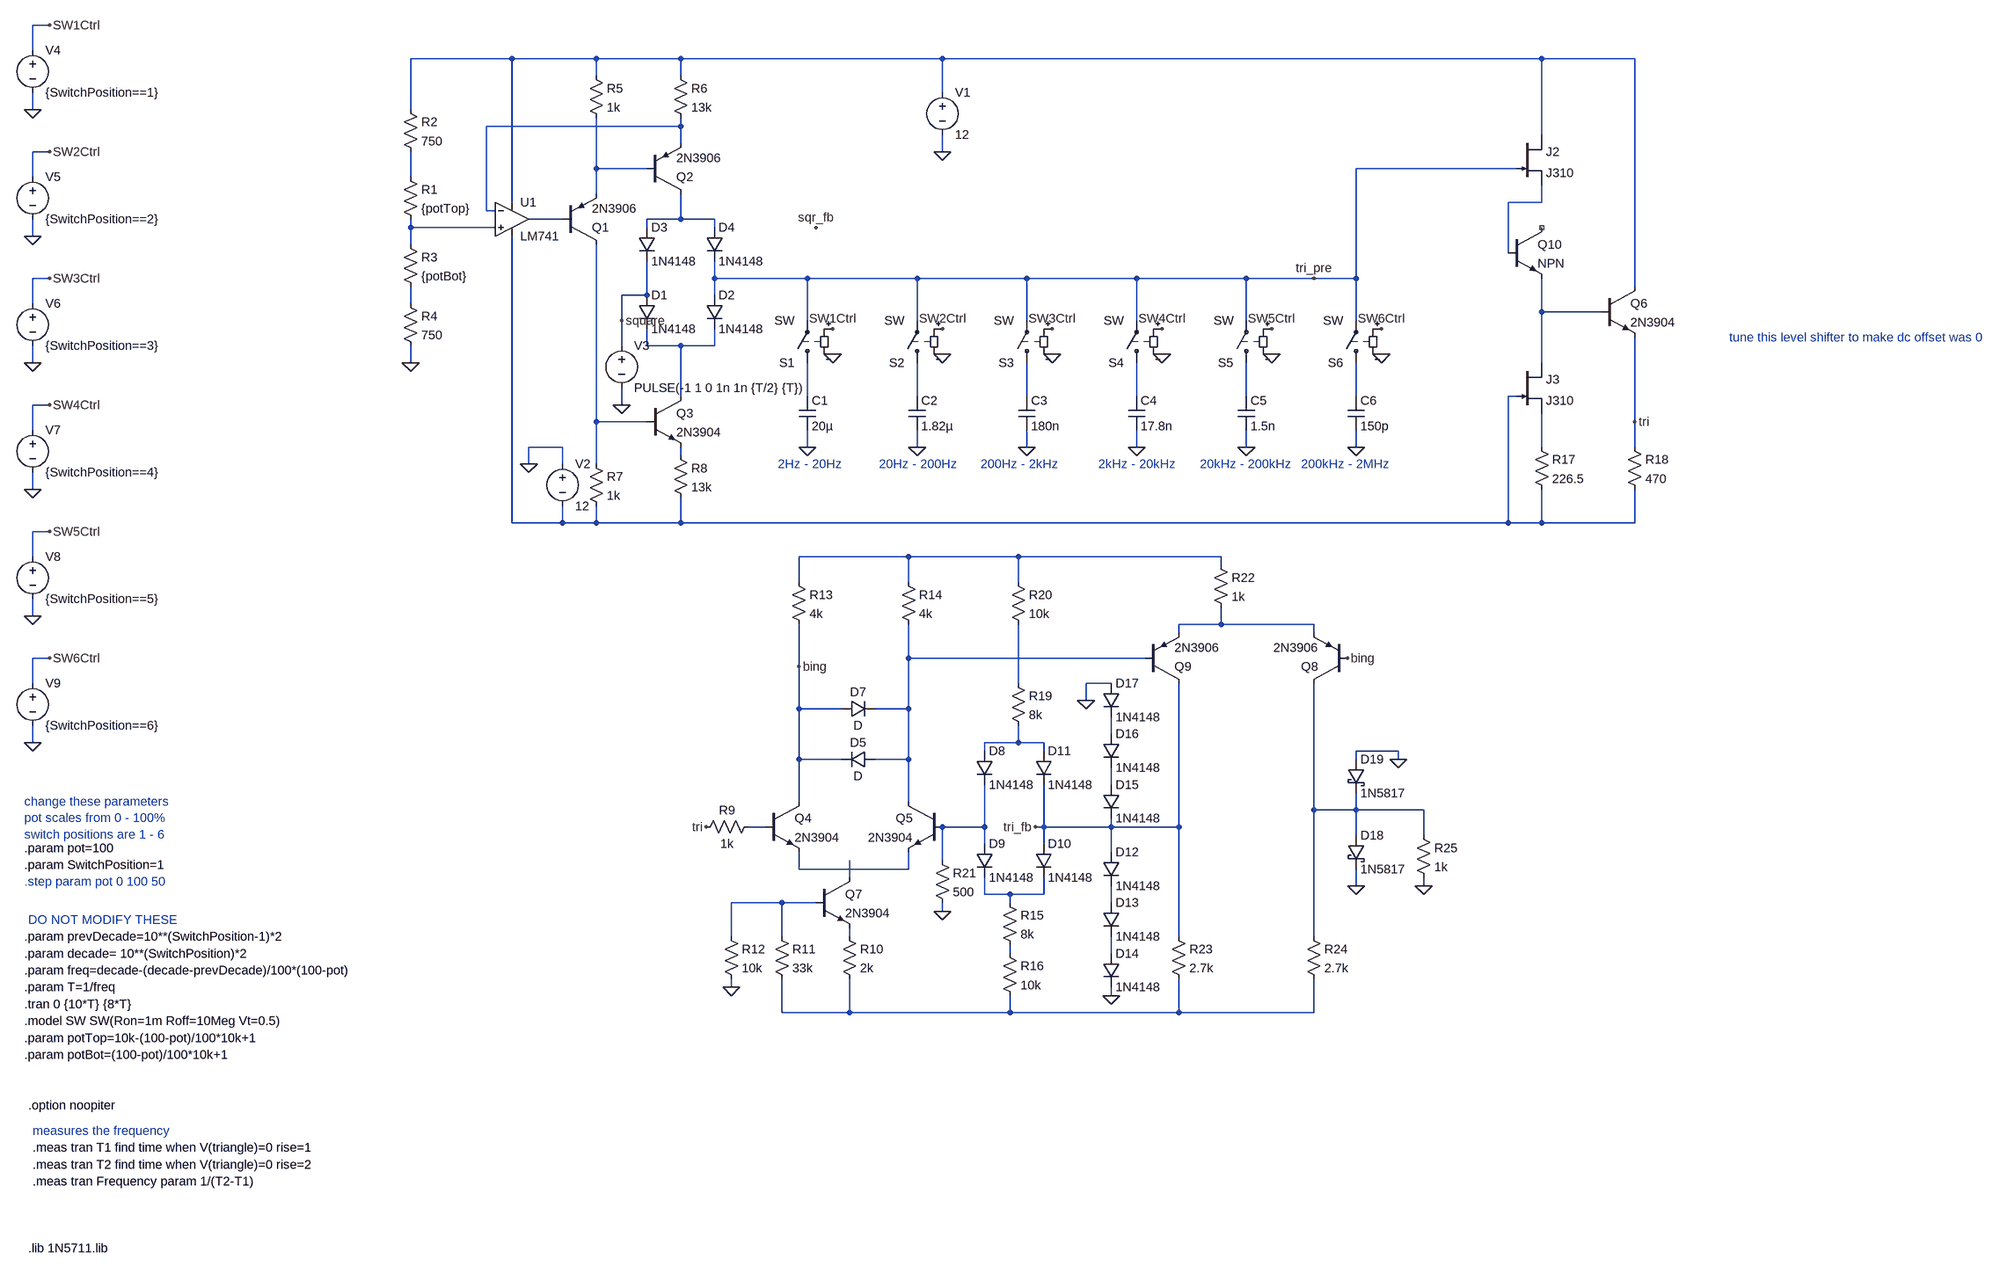
[diagram p0: schematic integrator.asc]
integrator.asc, the LTspice schematic file:
Version 4
SHEET 1 4740 2564
WIRE -464 -160 -496 -160
WIRE -496 -112 -496 -160
WIRE 784 -96 592 -96
WIRE 944 -96 784 -96
WIRE 1104 -96 944 -96
WIRE 1600 -96 1104 -96
WIRE 2736 -96 1600 -96
WIRE 2912 -96 2736 -96
WIRE 944 -64 944 -96
WIRE 1104 -64 1104 -96
WIRE 1600 -32 1600 -96
WIRE -496 0 -496 -32
WIRE 592 0 592 -96
WIRE 1104 32 1104 16
WIRE 1104 32 736 32
WIRE 2736 48 2736 -96
WIRE 1104 64 1104 32
WIRE -464 80 -496 80
WIRE 1600 80 1600 48
WIRE 944 112 944 16
WIRE 1040 112 944 112
WIRE 2688 112 2384 112
WIRE -496 128 -496 80
WIRE 592 128 592 80
WIRE 944 160 944 112
WIRE 784 176 784 -96
WIRE 2736 176 2736 144
WIRE 2736 176 2672 176
WIRE 736 192 736 32
WIRE 752 192 736 192
WIRE 880 208 816 208
WIRE 1104 208 1104 160
WIRE 1104 208 1040 208
WIRE 1168 208 1104 208
WIRE 592 224 592 208
WIRE 752 224 592 224
WIRE 1040 224 1040 208
WIRE 1168 224 1168 208
WIRE -496 240 -496 208
WIRE 592 256 592 224
WIRE 2672 272 2672 176
WIRE -464 320 -496 320
WIRE 1168 320 1168 288
WIRE 1344 320 1168 320
WIRE 1552 320 1344 320
WIRE 1760 320 1552 320
WIRE 1968 320 1760 320
WIRE 2176 320 1968 320
WIRE 2304 320 2176 320
WIRE 2384 320 2384 112
WIRE 2384 320 2304 320
WIRE 2912 336 2912 -96
WIRE 1040 352 1040 288
WIRE 1040 352 992 352
WIRE 1168 352 1168 320
WIRE -496 368 -496 320
WIRE 592 368 592 336
WIRE 2736 384 2736 320
WIRE 2848 384 2736 384
WIRE 992 400 992 352
WIRE 1344 400 1344 320
WIRE 1552 400 1552 320
WIRE 1760 400 1760 320
WIRE 1968 400 1968 320
WIRE 2176 400 2176 320
WIRE 2384 400 2384 320
WIRE 992 448 992 400
WIRE 1040 448 1040 416
WIRE 1104 448 1040 448
WIRE 1168 448 1168 416
WIRE 1168 448 1104 448
WIRE -496 480 -496 448
WIRE 592 480 592 448
WIRE 2736 480 2736 384
WIRE 1104 544 1104 448
WIRE 1344 544 1344 480
WIRE 1552 544 1552 480
WIRE 1760 544 1760 480
WIRE 1968 544 1968 480
WIRE 2176 544 2176 480
WIRE 2384 544 2384 480
WIRE 2688 544 2672 544
WIRE -464 560 -496 560
WIRE 992 560 992 528
WIRE 944 592 944 256
WIRE 1040 592 944 592
WIRE 2912 592 2912 432
WIRE -496 608 -496 560
WIRE 880 640 816 640
WIRE 1344 640 1344 608
WIRE 1552 640 1552 608
WIRE 1760 640 1760 608
WIRE 1968 640 1968 608
WIRE 2176 640 2176 608
WIRE 2384 640 2384 608
WIRE 2736 640 2736 576
WIRE 2912 640 2912 592
WIRE 1104 656 1104 640
WIRE 816 672 816 640
WIRE 880 672 880 640
WIRE 944 672 944 592
WIRE -496 720 -496 688
WIRE 784 784 784 240
WIRE 880 784 880 752
WIRE 880 784 784 784
WIRE 944 784 944 752
WIRE 944 784 880 784
WIRE 1104 784 1104 736
WIRE 1104 784 944 784
WIRE 2672 784 2672 544
WIRE 2672 784 1104 784
WIRE 2736 784 2736 720
WIRE 2736 784 2672 784
WIRE 2912 784 2912 720
WIRE 2912 784 2736 784
WIRE -464 800 -496 800
WIRE -496 848 -496 800
WIRE 1536 848 1328 848
WIRE 1744 848 1536 848
WIRE 2128 848 1744 848
WIRE 2128 864 2128 848
WIRE 1328 896 1328 848
WIRE 1536 896 1536 848
WIRE 1744 896 1744 848
WIRE -496 960 -496 928
WIRE 2128 976 2128 944
WIRE 2128 976 2048 976
WIRE 2304 976 2128 976
WIRE 2048 992 2048 976
WIRE 2304 992 2304 976
WIRE -464 1040 -496 1040
WIRE 1536 1040 1536 976
WIRE 1984 1040 1536 1040
WIRE 1328 1056 1328 976
WIRE -496 1088 -496 1040
WIRE 1744 1088 1744 976
WIRE 1920 1088 1872 1088
WIRE 1872 1120 1872 1088
WIRE 1328 1136 1328 1056
WIRE 1408 1136 1328 1136
WIRE 1536 1136 1536 1040
WIRE 1536 1136 1472 1136
WIRE 1920 1184 1920 1152
WIRE -496 1200 -496 1168
WIRE 1744 1200 1744 1168
WIRE 1744 1200 1680 1200
WIRE 1792 1200 1744 1200
WIRE 1680 1216 1680 1200
WIRE 1792 1216 1792 1200
WIRE 2464 1216 2384 1216
WIRE 1328 1232 1328 1136
WIRE 1408 1232 1328 1232
WIRE 1536 1232 1536 1136
WIRE 1536 1232 1472 1232
WIRE 2384 1232 2384 1216
WIRE 2464 1232 2464 1216
WIRE 1920 1280 1920 1248
WIRE 1328 1312 1328 1232
WIRE 1536 1312 1536 1232
WIRE 2304 1328 2304 1088
WIRE 2384 1328 2384 1296
WIRE 2384 1328 2304 1328
WIRE 2512 1328 2384 1328
WIRE 1264 1360 1232 1360
WIRE 1680 1360 1680 1280
WIRE 1680 1360 1600 1360
WIRE 1792 1360 1792 1280
WIRE 1792 1360 1776 1360
WIRE 1920 1360 1920 1344
WIRE 1920 1360 1792 1360
WIRE 2048 1360 2048 1088
WIRE 2048 1360 1920 1360
WIRE 2384 1376 2384 1328
WIRE 2512 1376 2512 1328
WIRE 1680 1392 1680 1360
WIRE 1792 1392 1792 1360
WIRE 1920 1408 1920 1360
WIRE 1600 1424 1600 1360
WIRE 1328 1440 1328 1408
WIRE 1536 1440 1536 1408
WIRE 1536 1440 1328 1440
WIRE 1424 1456 1424 1424
WIRE 2384 1472 2384 1440
WIRE 2512 1472 2512 1456
WIRE 1680 1488 1680 1456
WIRE 1728 1488 1680 1488
WIRE 1792 1488 1792 1456
WIRE 1792 1488 1728 1488
WIRE 1296 1504 1200 1504
WIRE 1360 1504 1296 1504
WIRE 1728 1504 1728 1488
WIRE 1920 1504 1920 1472
WIRE 1600 1520 1600 1504
WIRE 1200 1568 1200 1504
WIRE 1296 1568 1296 1504
WIRE 1424 1568 1424 1552
WIRE 2048 1568 2048 1360
WIRE 2304 1568 2304 1328
WIRE 1728 1600 1728 1584
WIRE 1920 1600 1920 1568
WIRE 1200 1664 1200 1648
WIRE 1920 1680 1920 1664
WIRE 1296 1712 1296 1648
WIRE 1424 1712 1424 1648
WIRE 1424 1712 1296 1712
WIRE 1728 1712 1728 1680
WIRE 1728 1712 1424 1712
WIRE 2048 1712 2048 1648
WIRE 2048 1712 1728 1712
WIRE 2304 1712 2304 1648
WIRE 2304 1712 2048 1712
FLAG 592 480 0
FLAG 1600 80 0
FLAG 816 672 0
FLAG 1344 640 0
FLAG 992 560 0
FLAG 992 400 square
FLAG 2304 320 tri_pre
FLAG 1552 640 0
FLAG 1760 640 0
FLAG 1968 640 0
FLAG 2384 640 0
FLAG 1392 464 0
FLAG 1600 464 0
FLAG 1808 464 0
FLAG 2016 464 0
FLAG 2224 464 0
FLAG 2432 464 0
FLAG -496 0 0
FLAG -464 -160 SW1Ctrl
FLAG -496 240 0
FLAG -496 480 0
FLAG -496 720 0
FLAG -496 960 0
FLAG -496 1200 0
FLAG -464 80 SW2Ctrl
FLAG -464 320 SW3Ctrl
FLAG -464 560 SW4Ctrl
FLAG -464 800 SW5Ctrl
FLAG -464 1040 SW6Ctrl
FLAG 1392 416 SW1Ctrl
FLAG 1600 416 SW2Ctrl
FLAG 1808 416 SW3Ctrl
FLAG 2016 416 SW4Ctrl
FLAG 2224 416 SW5Ctrl
FLAG 2432 416 SW6Ctrl
FLAG 2176 640 0
FLAG 2912 592 tri
FLAG 1200 1664 0
FLAG 1600 1520 0
FLAG 1920 1680 0
FLAG 1872 1120 0
FLAG 1328 1056 bing
FLAG 2368 1040 bing
FLAG 2512 1472 0
FLAG 2384 1472 0
FLAG 2464 1232 0
FLAG 1776 1360 tri_fb
FLAG 1152 1360 tri
FLAG 1360 224 sqr_fb
SYMBOL res 576 112 R0
SYMATTR InstName R1
SYMATTR Value {potTop}
SYMBOL res 576 -16 R0
SYMATTR InstName R2
SYMATTR Value 750
SYMBOL res 576 240 R0
SYMATTR InstName R3
SYMATTR Value {potBot}
SYMBOL res 576 352 R0
SYMATTR InstName R4
SYMATTR Value 750
SYMBOL voltage 1600 -48 R0
WINDOW 123 0 0 Left 0
WINDOW 39 0 0 Left 0
SYMATTR InstName V1
SYMATTR Value 12
SYMBOL OpAmps\\LM741 784 144 R0
SYMATTR InstName U1
SYMBOL pnp 880 256 M180
SYMATTR InstName Q1
SYMATTR Value 2N3906
SYMBOL res 928 -80 R0
SYMATTR InstName R5
SYMATTR Value 1k
SYMBOL res 1088 -80 R0
SYMATTR InstName R6
SYMATTR Value 13k
SYMBOL pnp 1040 160 M180
SYMATTR InstName Q2
SYMATTR Value 2N3906
SYMBOL res 928 656 R0
SYMATTR InstName R7
SYMATTR Value 1k
SYMBOL npn 1040 544 R0
SYMATTR InstName Q3
SYMATTR Value 2N3904
SYMBOL voltage 880 656 R0
WINDOW 123 0 0 Left 0
WINDOW 39 0 0 Left 0
SYMATTR InstName V2
SYMATTR Value 12
SYMBOL cap 1328 544 R0
SYMATTR InstName C1
SYMATTR Value 20µ
SYMBOL voltage 992 432 R0
WINDOW 123 0 0 Left 0
WINDOW 39 0 0 Left 0
SYMATTR InstName V3
SYMATTR Value PULSE(-1 1 0 1n 1n {T/2} {T})
SYMBOL res 1088 640 R0
SYMATTR InstName R8
SYMATTR Value 13k
SYMBOL sw 1344 496 R180
SYMATTR InstName S1
SYMBOL cap 1536 544 R0
SYMATTR InstName C2
SYMATTR Value 1.82µ
SYMBOL sw 1552 496 R180
SYMATTR InstName S2
SYMBOL cap 1744 544 R0
SYMATTR InstName C3
SYMATTR Value 180n
SYMBOL sw 1760 496 R180
SYMATTR InstName S3
SYMBOL cap 1952 544 R0
SYMATTR InstName C4
SYMATTR Value 17.8n
SYMBOL sw 1968 496 R180
SYMATTR InstName S4
SYMBOL sw 2176 496 R180
SYMATTR InstName S5
SYMBOL cap 2368 544 R0
SYMATTR InstName C6
SYMATTR Value 150p
SYMBOL sw 2384 496 R180
SYMATTR InstName S6
SYMBOL voltage -496 -128 R0
WINDOW 123 0 0 Left 0
WINDOW 39 0 0 Left 0
SYMATTR InstName V4
SYMATTR Value {SwitchPosition==1}
SYMBOL voltage -496 112 R0
WINDOW 123 0 0 Left 0
WINDOW 39 0 0 Left 0
SYMATTR InstName V5
SYMATTR Value {SwitchPosition==2}
SYMBOL voltage -496 352 R0
WINDOW 123 0 0 Left 0
WINDOW 39 0 0 Left 0
SYMATTR InstName V6
SYMATTR Value {SwitchPosition==3}
SYMBOL voltage -496 592 R0
WINDOW 123 0 0 Left 0
WINDOW 39 0 0 Left 0
SYMATTR InstName V7
SYMATTR Value {SwitchPosition==4}
SYMBOL voltage -496 832 R0
WINDOW 123 0 0 Left 0
WINDOW 39 0 0 Left 0
SYMATTR InstName V8
SYMATTR Value {SwitchPosition==5}
SYMBOL voltage -496 1072 R0
WINDOW 123 0 0 Left 0
WINDOW 39 0 0 Left 0
SYMATTR InstName V9
SYMATTR Value {SwitchPosition==6}
SYMBOL cap 2160 544 R0
SYMATTR InstName C5
SYMATTR Value 1.5n
SYMBOL diode 1024 224 R0
SYMATTR InstName D3
SYMATTR Value 1N4148
SYMBOL diode 1024 352 R0
SYMATTR InstName D1
SYMATTR Value 1N4148
SYMBOL diode 1152 352 R0
SYMATTR InstName D2
SYMATTR Value 1N4148
SYMBOL diode 1152 224 R0
SYMATTR InstName D4
SYMATTR Value 1N4148
SYMBOL njf 2688 48 R0
SYMATTR InstName J2
SYMATTR Value J310
SYMBOL njf 2688 480 R0
SYMATTR InstName J3
SYMATTR Value J310
SYMBOL res 2720 624 R0
SYMATTR InstName R17
SYMATTR Value 226.5
SYMBOL npn 2848 336 R0
SYMATTR InstName Q6
SYMATTR Value 2N3904
SYMBOL res 2896 624 R0
SYMATTR InstName R18
SYMATTR Value 470
SYMBOL res 1248 1344 R90
WINDOW 0 0 56 VBottom 2
WINDOW 3 32 56 VTop 2
SYMATTR InstName R9
SYMATTR Value 1k
SYMBOL npn 1264 1312 R0
SYMATTR InstName Q4
SYMATTR Value 2N3904
SYMBOL npn 1600 1312 M0
SYMATTR InstName Q5
SYMATTR Value 2N3904
SYMBOL npn 1360 1456 R0
SYMATTR InstName Q7
SYMATTR Value 2N3904
SYMBOL res 1408 1552 R0
SYMATTR InstName R10
SYMATTR Value 2k
SYMBOL res 1280 1552 R0
SYMATTR InstName R11
SYMATTR Value 33k
SYMBOL res 1184 1552 R0
SYMATTR InstName R12
SYMATTR Value 10k
SYMBOL diode 1472 1216 R90
WINDOW 0 0 32 VBottom 2
WINDOW 3 32 32 VTop 2
SYMATTR InstName D5
SYMBOL diode 1408 1152 R270
WINDOW 0 32 32 VTop 2
WINDOW 3 0 32 VBottom 2
SYMATTR InstName D7
SYMBOL res 1312 880 R0
SYMATTR InstName R13
SYMATTR Value 4k
SYMBOL res 1520 880 R0
SYMATTR InstName R14
SYMATTR Value 4k
SYMBOL diode 1664 1216 R0
SYMATTR InstName D8
SYMATTR Value 1N4148
SYMBOL res 1712 1488 R0
SYMATTR InstName R15
SYMATTR Value 8k
SYMBOL res 1712 1584 R0
SYMATTR InstName R16
SYMATTR Value 10k
SYMBOL res 1728 1072 R0
SYMATTR InstName R19
SYMATTR Value 8k
SYMBOL res 1728 880 R0
SYMATTR InstName R20
SYMATTR Value 10k
SYMBOL res 1584 1408 R0
SYMATTR InstName R21
SYMATTR Value 500
SYMBOL diode 1904 1408 R0
SYMATTR InstName D12
SYMATTR Value 1N4148
SYMBOL res 2112 848 R0
SYMATTR InstName R22
SYMATTR Value 1k
SYMBOL res 2032 1552 R0
SYMATTR InstName R23
SYMATTR Value 2.7k
SYMBOL res 2288 1552 R0
SYMATTR InstName R24
SYMATTR Value 2.7k
SYMBOL pnp 2368 1088 R180
SYMATTR InstName Q8
SYMATTR Value 2N3906
SYMBOL pnp 1984 1088 M180
SYMATTR InstName Q9
SYMATTR Value 2N3906
SYMBOL diode 1664 1392 R0
SYMATTR InstName D9
SYMATTR Value 1N4148
SYMBOL diode 1776 1392 R0
SYMATTR InstName D10
SYMATTR Value 1N4148
SYMBOL diode 1776 1216 R0
SYMATTR InstName D11
SYMATTR Value 1N4148
SYMBOL diode 1904 1504 R0
SYMATTR InstName D13
SYMATTR Value 1N4148
SYMBOL diode 1904 1600 R0
SYMATTR InstName D14
SYMATTR Value 1N4148
SYMBOL diode 1904 1280 R0
SYMATTR InstName D15
SYMATTR Value 1N4148
SYMBOL diode 1904 1184 R0
SYMATTR InstName D16
SYMATTR Value 1N4148
SYMBOL diode 1904 1088 R0
SYMATTR InstName D17
SYMATTR Value 1N4148
SYMBOL schottky 2368 1376 R0
SYMATTR InstName D18
SYMATTR Value 1N5817
SYMATTR Description Diode
SYMATTR Type diode
SYMBOL schottky 2368 1232 R0
SYMATTR InstName D19
SYMATTR Value 1N5817
SYMATTR Description Diode
SYMATTR Type diode
SYMBOL res 2496 1360 R0
SYMATTR InstName R25
SYMATTR Value 1k
SYMBOL npn 2672 224 R0
SYMATTR InstName Q10
TEXT -512 1400 Left 2 !.param pot=100
TEXT -512 1696 Left 2 !.tran 0 {10*T} {8*T}
TEXT -512 1432 Left 2 !.param SwitchPosition=1
TEXT -512 1728 Left 2 !.model SW SW(Ron=1m Roff=10Meg Vt=0.5)
TEXT -512 1600 Left 2 !.param decade= 10**(SwitchPosition)*2
TEXT -512 1632 Left 2 !.param freq=decade-(decade-prevDecade)/100*(100-pot)
TEXT -512 1664 Left 2 !.param T=1/freq
TEXT -512 1760 Left 2 !.param potTop=10k-(100-pot)/100*10k+1
TEXT -512 1792 Left 2 !.param potBot=(100-pot)/100*10k+1
TEXT -512 1568 Left 2 !.param prevDecade=10**(SwitchPosition-1)*2
TEXT -496 1968 Left 2 !.meas tran T1 find time when V(triangle)=0 rise=1
TEXT -496 2000 Left 2 !.meas tran T2 find time when V(triangle)=0 rise=2
TEXT -496 2032 Left 2 !.meas tran Frequency param 1/(T2-T1)
TEXT -504 1888 Left 2 !.option noopiter
TEXT -496 1936 Left 2 ;measures the frequency
TEXT -512 1312 Left 2 ;change these parameters\npot scales from 0 - 100%\nswitch positions are 1 - 6
TEXT -504 1536 Left 2 ;DO NOT MODIFY THESE
TEXT -504 2160 Left 2 !.lib 1N5711.lib
TEXT 1288 672 Left 2 ;2Hz - 20Hz
TEXT 1480 672 Left 2 ;20Hz - 200Hz
TEXT 1672 672 Left 2 ;200Hz - 2kHz
TEXT 1896 672 Left 2 ;2kHz - 20kHz
TEXT 2088 672 Left 2 ;20kHz - 200kHz
TEXT 2280 672 Left 2 ;200kHz - 2MHz
TEXT -512 1464 Left 2 ;.step param pot 0 100 50
TEXT 3680 432 Left 2 ;tune this level shifter to make dc offset was 0

The netlist it stands for:
* integrator.asc
R1 N004 N008 {potTop}
R2 N001 N004 750
R3 N008 N009 {potBot}
R4 N009 0 750
V1 N001 0 12
XU1 N008 N002 N001 N018 N006 LM741  ; pins In+ In- V+ V- OUT
Q1 N019 N006 N003 0 2N3906
R5 N001 N003 1k
R6 N001 N002 13k
Q2 N007 N003 N002 0 2N3906
R7 N019 N018 1k
Q3 N011 N019 N021 0 2N3904
V2 0 N018 12
C1 N012 0 20µ
V3 square 0 PULSE(-1 1 0 1n 1n {T/2} {T})
R8 N021 N018 13k
S1 N012 tri_pre SW1Ctrl 0 SW
C2 N013 0 1.82µ
S2 N013 tri_pre SW2Ctrl 0 SW
C3 N014 0 180n
S3 N014 tri_pre SW3Ctrl 0 SW
C4 N015 0 17.8n
S4 N015 tri_pre SW4Ctrl 0 SW
S5 N016 tri_pre SW5Ctrl 0 SW
C6 N017 0 150p
S6 N017 tri_pre SW6Ctrl 0 SW
V4 SW1Ctrl 0 {SwitchPosition==1}
V5 SW2Ctrl 0 {SwitchPosition==2}
V6 SW3Ctrl 0 {SwitchPosition==3}
V7 SW4Ctrl 0 {SwitchPosition==4}
V8 SW5Ctrl 0 {SwitchPosition==5}
V9 SW6Ctrl 0 {SwitchPosition==6}
C5 N016 0 1.5n
D3 N007 square 1N4148
D1 square N011 1N4148
D2 tri_pre N011 1N4148
D4 N007 tri_pre 1N4148
J2 N001 tri_pre N005 J310
J3 N010 N018 N020 J310
R17 N020 N018 226.5
Q6 N001 N010 tri 0 2N3904
R18 tri N018 470
R9 N030 tri 1k
Q4 bing N030 N032 0 2N3904
Q5 N024 N031 N032 0 2N3904
Q7 N033 N035 N037 0 2N3904
R10 N037 N040 2k
R11 N035 N040 33k
R12 N035 0 10k
D5 N024 bing D
D7 bing N024 D
R13 N022 bing 4k
R14 N022 N024 4k
D8 N027 N031 1N4148
R15 N034 N038 8k
R16 N038 N040 10k
R19 N025 N027 8k
R20 N022 N025 10k
R21 N031 0 500
D12 tri_fb N036 1N4148
R22 N022 N023 1k
R23 tri_fb N040 2.7k
R24 N029 N040 2.7k
Q8 N029 bing N023 0 2N3906
Q9 tri_fb N024 N023 0 2N3906
D9 N031 N034 1N4148
D10 tri_fb N034 1N4148
D11 N027 tri_fb 1N4148
D13 N036 N039 1N4148
D14 N039 0 1N4148
D15 N028 tri_fb 1N4148
D16 N026 N028 1N4148
D17 0 N026 1N4148
D18 N029 0 1N5817
D19 0 N029 1N5817
R25 N029 0 1k
Q10 NC_01 N005 N010 0 NPN
.model D D
.lib standard.dio
.model NPN NPN
.model PNP PNP
.lib standard.bjt
.model NJF NJF
.model PJF PJF
.lib standard.jft
.param pot=100
.tran 0 {10*T} {8*T}
.param SwitchPosition=1
.model SW SW(Ron=1m Roff=10Meg Vt=0.5)
.param decade= 10**(SwitchPosition)*2
.param freq=decade-(decade-prevDecade)/100*(100-pot)
.param T=1/freq
.param potTop=10k-(100-pot)/100*10k+1
.param potBot=(100-pot)/100*10k+1
.param prevDecade=10**(SwitchPosition-1)*2
.meas tran T1 find time when V(triangle)=0 rise=1
.meas tran T2 find time when V(triangle)=0 rise=2
.meas tran Frequency param 1/(T2-T1)
.option noopiter
* measures the frequency
* change these parameters
* pot scales from 0 - 100%
* switch positions are 1 - 6
* DO NOT MODIFY THESE
.lib 1N5711.lib
* 2Hz - 20Hz
* 20Hz - 200Hz
* 200Hz - 2kHz
* 2kHz - 20kHz
* 20kHz - 200kHz
* 200kHz - 2MHz
* .step param pot 0 100 50
* tune this level shifter to make dc offset was 0
.lib LM741.lib
.backanno
.end